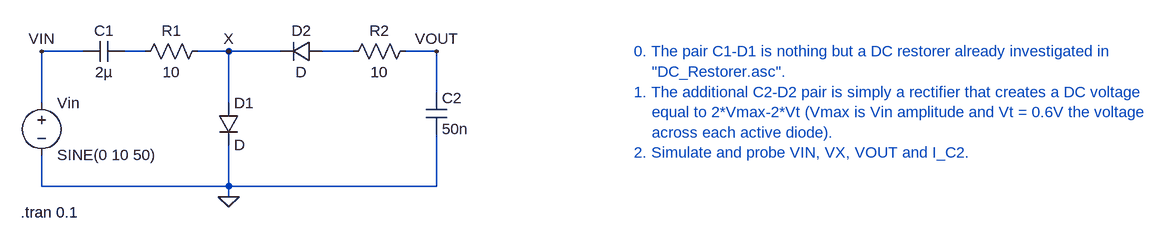
[diagram p0: schematic Voltage_Doubler_AC_DC.asc]
Voltage_Doubler_AC_DC.asc, the LTspice schematic file:
Version 4
SHEET 1 1368 680
WIRE -1776 144 -1840 144
WIRE -1680 144 -1712 144
WIRE -1552 144 -1600 144
WIRE -1472 144 -1552 144
WIRE -1360 144 -1408 144
WIRE -1232 144 -1280 144
WIRE -1232 208 -1232 144
WIRE -1840 224 -1840 144
WIRE -1552 224 -1552 144
WIRE -1840 352 -1840 304
WIRE -1552 352 -1552 288
WIRE -1552 352 -1840 352
WIRE -1232 352 -1232 272
WIRE -1232 352 -1552 352
WIRE -1552 368 -1552 352
FLAG -1552 368 0
FLAG -1552 144 X
FLAG -1840 144 VIN
FLAG -1232 144 VOUT
SYMBOL voltage -1840 208 R0
WINDOW 123 0 0 Left 0
WINDOW 39 0 0 Left 0
SYMATTR InstName Vin
SYMATTR Value SINE(0 10 50)
SYMBOL cap -1712 128 R90
WINDOW 0 0 32 VBottom 2
WINDOW 3 32 32 VTop 2
SYMATTR InstName C1
SYMATTR Value 2µ
SYMBOL diode -1568 224 R0
SYMATTR InstName D1
SYMBOL diode -1408 128 R90
WINDOW 0 0 32 VBottom 2
WINDOW 3 32 32 VTop 2
SYMATTR InstName D2
SYMBOL cap -1248 208 R0
SYMATTR InstName C2
SYMATTR Value 50n
SYMBOL res -1584 128 R90
WINDOW 0 0 56 VBottom 2
WINDOW 3 32 56 VTop 2
SYMATTR InstName R1
SYMATTR Value 10
SYMBOL res -1264 128 R90
WINDOW 0 0 56 VBottom 2
WINDOW 3 32 56 VTop 2
SYMATTR InstName R2
SYMATTR Value 10
TEXT -1872 392 Left 2 !.tran 0.1
TEXT -928 144 Left 2 ;0. The pair C1-D1 is nothing but a DC restorer already investigated in\n    "DC_Restorer.asc".\n1. The additional C2-D2 pair is simply a rectifier that creates a DC voltage\n    equal to 2*Vmax-2*Vt (Vmax is Vin amplitude and Vt = 0.6V the voltage\n    across each active diode).\n2. Simulate and probe VIN, VX, VOUT and I_C2.

The netlist it stands for:
* Voltage_Doubler_AC_DC.asc
Vin VIN 0 SINE(0 10 50)
C1 N001 VIN 2µ
D1 X 0 D
D2 N002 X D
C2 VOUT 0 50n
R1 X N001 10
R2 VOUT N002 10
.model D D
.lib standard.dio
.tran 0.1
* 0. The pair C1-D1 is nothing but a DC restorer already investigated in
*     "DC_Restorer.asc".
* 1. The additional C2-D2 pair is simply a rectifier that creates a DC voltage
*     equal to 2*Vmax-2*Vt (Vmax is Vin amplitude and Vt = 0.6V the voltage
*     across each active diode).
* 2. Simulate and probe VIN, VX, VOUT and I_C2.
.backanno
.end